# Altium schematic sheet Microcontroller IO.SchDoc: Microcontroller IO
size Letter; DrawnBy: Leonardo Marquez; Organization: Open Reflow Oven; Address1: leonardomarquez.com; Address2: github.com/marqueztronics; DocumentNumber: 001; Revision: A02; SheetNumber: 3; SheetTotal: 5
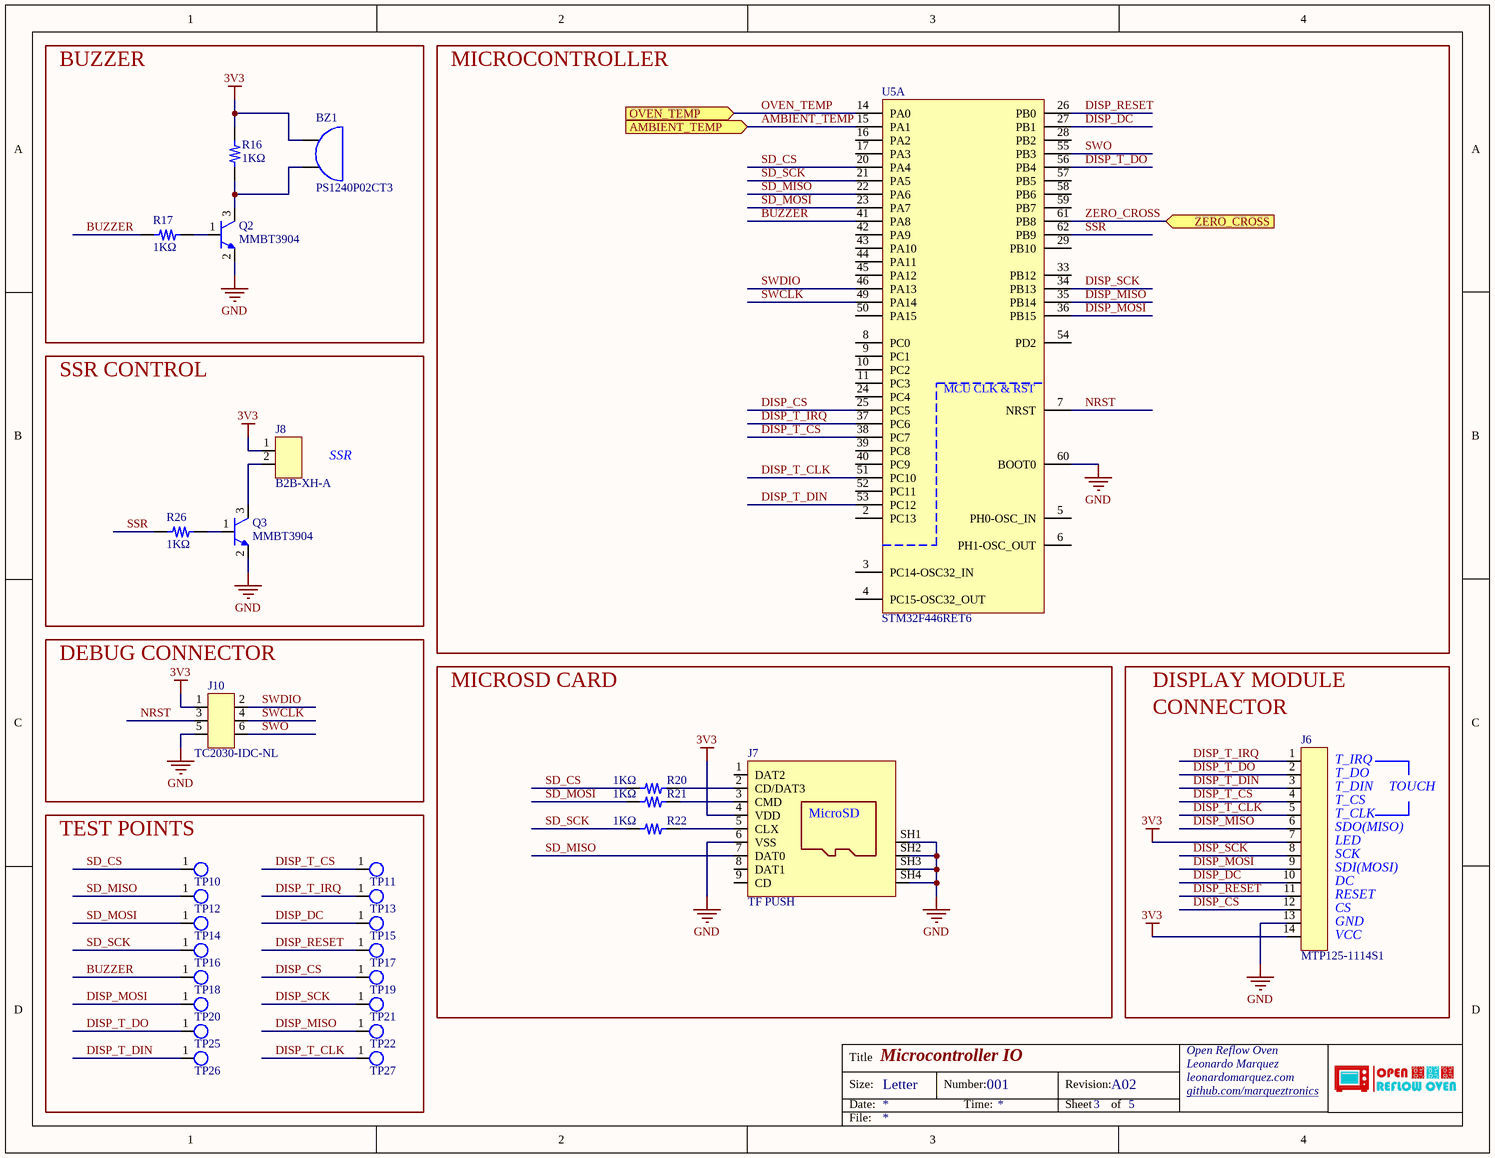
[diagram p0: Microcontroller IO.SchDoc]

## Parts
BZ1  PS1240P02CT3  [PS1240P02CT3]
J6  MTP125-1114S1  [MTP125-1114S1]
J7  TF PUSH  [TF_PUSH]
J8  B2B-XH-A  [B2B-XH-A]
J10  TC2030-IDC-NL  [TC2030-IDC-NL-FP]  (no BOM)
Q2  MMBT3904  [SOT-23]
Q3  MMBT3904  [SOT-23]
R16  1KΩ  [R0603]
R17  1KΩ  [R0603]
R20  1KΩ  [R0603]
R21  1KΩ  [R0603]
R22  1KΩ  [R0603]
R26  1KΩ  [R0603]
TP10  TP-1MM-ROUND  [TP-1MM-ROUND]  (value not drawn)  (no BOM)
TP11  TP-1MM-ROUND  [TP-1MM-ROUND]  (value not drawn)  (no BOM)
TP12  TP-1MM-ROUND  [TP-1MM-ROUND]  (value not drawn)  (no BOM)
TP13  TP-1MM-ROUND  [TP-1MM-ROUND]  (value not drawn)  (no BOM)
TP14  TP-1MM-ROUND  [TP-1MM-ROUND]  (value not drawn)  (no BOM)
TP15  TP-1MM-ROUND  [TP-1MM-ROUND]  (value not drawn)  (no BOM)
TP16  TP-1MM-ROUND  [TP-1MM-ROUND]  (value not drawn)  (no BOM)
TP17  TP-1MM-ROUND  [TP-1MM-ROUND]  (value not drawn)  (no BOM)
TP18  TP-1MM-ROUND  [TP-1MM-ROUND]  (value not drawn)  (no BOM)
TP19  TP-1MM-ROUND  [TP-1MM-ROUND]  (value not drawn)  (no BOM)
TP20  TP-1MM-ROUND  [TP-1MM-ROUND]  (value not drawn)  (no BOM)
TP21  TP-1MM-ROUND  [TP-1MM-ROUND]  (value not drawn)  (no BOM)
TP22  TP-1MM-ROUND  [TP-1MM-ROUND]  (value not drawn)  (no BOM)
TP25  TP-1MM-ROUND  [TP-1MM-ROUND]  (value not drawn)  (no BOM)
TP26  TP-1MM-ROUND  [TP-1MM-ROUND]  (value not drawn)  (no BOM)
TP27  TP-1MM-ROUND  [TP-1MM-ROUND]  (value not drawn)  (no BOM)
U5  STM32F446RET6  [LQFP-64_10X10]  (part A of 2)

## Blocks framed on the sheet
BUZZER: BZ1 Q2 R16 R17
MICROCONTROLLER: U5
SSR CONTROL: J8 Q3 R26
DEBUG CONNECTOR: J10
MICROSD CARD: J7 R20-R22
TEST POINTS: TP10-TP22 TP25-TP27

## Ports
AMBIENT_TEMP (in), OVEN_TEMP (in), ZERO_CROSS (in)

## Nets
3V3: BZ1.1 J6.7 J6.14 J7.4(VDD) J8.1 J10.1 R16.2
GND: J6.13 J7.6(VSS) J7.SH1(SHIELD) J7.SH2(SHIELD) J7.SH3(SHIELD) J7.SH4(SHIELD) J10.5 Q2.2(E) Q3.2(E) U5.60(BOOT0)
AMBIENT_TEMP: U5.15(PA1) ; port AMBIENT_TEMP
BUZZER: R17.2 TP18.1 U5.41(PA8)
DISP_CS: J6.12 TP19.1 U5.25(PC5)
DISP_DC: J6.10 TP15.1 U5.27(PB1)
DISP_MISO: J6.6 TP22.1 U5.35(PB14)
DISP_MOSI: J6.9 TP20.1 U5.36(PB15)
DISP_RESET: J6.11 TP17.1 U5.26(PB0)
DISP_SCK: J6.8 TP21.1 U5.34(PB13)
DISP_T_CLK: J6.5 TP27.1 U5.51(PC10)
DISP_T_CS: J6.4 TP11.1 U5.38(PC7)
DISP_T_DIN: J6.3 TP26.1 U5.53(PC12)
DISP_T_DO: J6.2 TP25.1 U5.56(PB4)
DISP_T_IRQ: J6.1 TP13.1 U5.37(PC6)
NRST: J10.3 U5.7(NRST)
OVEN_TEMP: U5.14(PA0) ; port OVEN_TEMP
SD_CS: R20.2 TP10.1 U5.20(PA4)
SD_MISO: J7.7(DAT0) TP12.1 U5.22(PA6)
SD_MOSI: R21.2 TP14.1 U5.23(PA7)
SD_SCK: R22.2 TP16.1 U5.21(PA5)
SSR: R26.2 U5.62(PB9)
SWCLK: J10.4 U5.49(PA14)
SWDIO: J10.2 U5.46(PA13)
SWO: J10.6 U5.55(PB3)
ZERO_CROSS: U5.61(PB8) ; port ZERO_CROSS
NetBZ1_2: BZ1.2 Q2.3(C) R16.1
NetJ7_2: J7.2(CD/DAT3) R20.1
NetJ7_3: J7.3(CMD) R21.1
NetJ7_5: J7.5(CLX) R22.1
NetJ8_2: J8.2 Q3.3(C)
NetQ2_1: Q2.1(B) R17.1
NetQ3_1: Q3.1(B) R26.1

Not connected (* = marked no-connect by the designer): J7 1(DAT2) 8(DAT1) 9(CD); U5 2(PC13) 3(PC14-OSC32_IN) 4(PC15-OSC32_OUT) 5(PH0-OSC_IN) 6(PH1-OSC_OUT) 8(PC0) 9(PC1) 10(PC2) 11(PC3) 16(PA2) 17(PA3) 24(PC4) 28(PB2) 29(PB10) 33(PB12) 39(PC8) 40(PC9) 42(PA9) 43(PA10) 44(PA11) 45(PA12) 50(PA15) 52(PC11) 54(PD2) 57(PB5) 58(PB6) 59(PB7)

## Notes on the sheet
- (near J8) SSR
- DISPLAY MODULE
- CONNECTOR
- (near J6) T_IRQ
- (near J6) T_DO
- (near J6) T_DIN
- (near J6) T_CS
- (near J6) T_CLK
- (near J6) SDO(MISO)
- TOUCH
- (near J6) LED
- (near J6) SCK
- (near J6) SDI(MOSI)
- (near J6) DC
- (near J6) RESET
- (near J6) CS
- (near J6) GND
- (near J6) VCC
- Title
- Size:
- Date:
- Letter
- Number:
- Time:
- Revision:
- Sheet
- of
- File:
- (in symbol J-MICROSD-TF_PUSH) MicroSD
- (in symbol U-STM32F446RET6-LQFP-64_10X10, part A) MCU CLK & RST

## Library data of the parts
BZ1 = BZ-4KHZ-30V-PS1240P02CT3: 60dB Externally Driven Externally Driven 4kHz Plugin,D=12.2mm Buzzers ROHS; Manufacturer: TDK; Manufacturer Part Number: PS1240P02CT3; Price Unit: 0.2373; Price 1K: 0.1495; Supplier 1: LCSC; Supplier Part Number 1: C76873
J6 = J-14P-HDR-MALE-2.54MM-MTP125-1114S1: 14P 2.54mm Single Row 1x14P Plugin,P=2.54mm Pin Headers ROHS; Manufacturer: MINTRON; Manufacturer Part Number: MTP125-1114S1; Price Unit: 0.0696; Price 1K: 0.0435; Supplier 1: LCSC; Supplier Part Number 1: C5142340
J7 = J-MICROSD-TF_PUSH: -20℃~+90℃ 2mm Card Slot MicroSD card (TF card) Self-bouncing SMD SD Card / Memory Card Connector ROHS; Manufacturer: SHOU HAN; Manufacturer Part Number: TF PUSH; Price Unit: 0.0465; Price 1K: 0.03; Supplier 1: LCSC; Supplier Part Number 1: C393941
J8 = J-2P-2.5MM-B2B-XH-A: 1x2P 2P XH 1 2.5mm 2 Brass Plugin,P=2.5mm Wire To Board Connector ROHS; Manufacturer: JST; Manufacturer Part Number: B2B-XH-A(LF)(SN); Price Unit: 0.0301; Price 1K: 0.0208; Supplier 1: LCSC; Supplier Part Number 1: C158012
J10 = J-6P-TAG-CONNECT-TC2030-IDC-NL-FP: “No Legs” 6-pin Plug-of-Nails™ Cable fitted with a 6-pin 0.1″ pitch ribbon connector; Manufacturer: Tag-Connect; Supplier 1: Tag-Connect; Supplier Part Number 1: TC2030-IDC-NL; Manufacturer Part Number: TC2030-IDC-NL; Price Unit: 0.00; Price 1K: 0.00
Q2 Q3 = Q-NPN-40V-0.2A-SOT-23: 40V 250mW 200mA NPN SOT-23 Bipolar Transistors - BJT ROHS; Manufacturer: Nexperia; Manufacturer Part Number: MMBT3904; Price Unit: 0.0155; Price 1K: 0.0124; Supplier 1: LCSC; Supplier Part Number 1: C108429
R16 R17 R20-R22 R26 = R-1K-1/10W-R0603: 100mW Thick Film Resistors 75V ±100ppm/℃ ±1% 1kΩ 0603 Chip Resistor - Surface Mount ROHS; Manufacturer: Yageo; Manufacturer Part Number: RC0603FR-071KL; Price Unit: 0.001; Price 1K: 0.0008; Supplier 1: LCSC; Supplier Part Number 1: C22548
TP10-TP22 TP25-TP27 = TP-1MM-ROUND: Round Test Point 1mm Dia
U5 = U-STM32F446RET6-LQFP-64_10X10: 512KB 1.7V~3.6V ARM-M4 128KB 180MHz FLASH 50 LQFP-64(10x10) Microcontrollers (MCU/MPU/SOC) ROHS; Manufacturer: STMicroelectronics; Manufacturer Part Number: STM32F446RET6; Price Unit: 3.3018; Price 1K: 2.3276; Supplier 1: LCSC; Supplier Part Number 1: C69336